# Altium project 40A DC-DC.PrjPcb
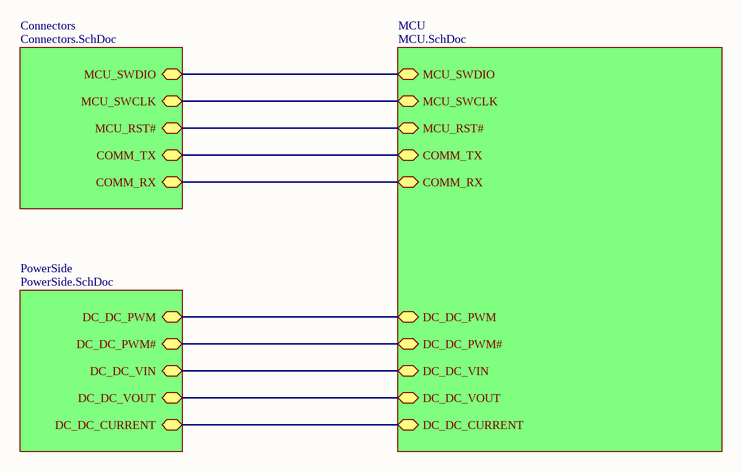
[diagram p0: Main.SchDoc]
ProjectAuthor: NeoProg; ProjectRevision: 1.00; ProjectStatus: D
4 sheets, 72 parts. Net scope: hierarchical (ports join the sheet entries above them; power ports are global).
Board file: PCB.PcbDoc
Sheets:
  Main.SchDoc
    Connectors = Connectors.SchDoc
    MCU = MCU.SchDoc
    PowerSide = PowerSide.SchDoc

## Sheet Main.SchDoc
size A4; DocumentNumber: 1; SheetNumber: 1; SheetTotal: 6

### Sub-sheets
Connectors = Connectors.SchDoc: MCU_SWDIO, MCU_SWCLK, MCU_RST#, COMM_TX, COMM_RX
MCU = MCU.SchDoc: MCU_SWDIO, MCU_SWCLK, MCU_RST#, DC_DC_PWM, DC_DC_PWM#, DC_DC_VIN, DC_DC_VOUT, DC_DC_CURRENT, COMM_TX, COMM_RX
PowerSide = PowerSide.SchDoc: DC_DC_PWM, DC_DC_PWM#, DC_DC_VIN, DC_DC_VOUT, DC_DC_CURRENT

### Nets
COMM_RX: sheet Connectors/COMM_RX, sheet MCU/COMM_RX
COMM_TX: sheet Connectors/COMM_TX, sheet MCU/COMM_TX
DC_DC_CURRENT: sheet MCU/DC_DC_CURRENT, sheet PowerSide/DC_DC_CURRENT
DC_DC_PWM: sheet MCU/DC_DC_PWM, sheet PowerSide/DC_DC_PWM
DC_DC_PWM#: sheet MCU/DC_DC_PWM#, sheet PowerSide/DC_DC_PWM#
DC_DC_VIN: sheet MCU/DC_DC_VIN, sheet PowerSide/DC_DC_VIN
DC_DC_VOUT: sheet MCU/DC_DC_VOUT, sheet PowerSide/DC_DC_VOUT
MCU_RST#: sheet Connectors/MCU_RST#, sheet MCU/MCU_RST#
MCU_SWCLK: sheet Connectors/MCU_SWCLK, sheet MCU/MCU_SWCLK
MCU_SWDIO: sheet Connectors/MCU_SWDIO, sheet MCU/MCU_SWDIO

### Notes on the sheet
- Project:
- Title:
- HW Rev:
- Author:
- Date:
- Sheet
- of

## Sheet Connectors.SchDoc
size A4
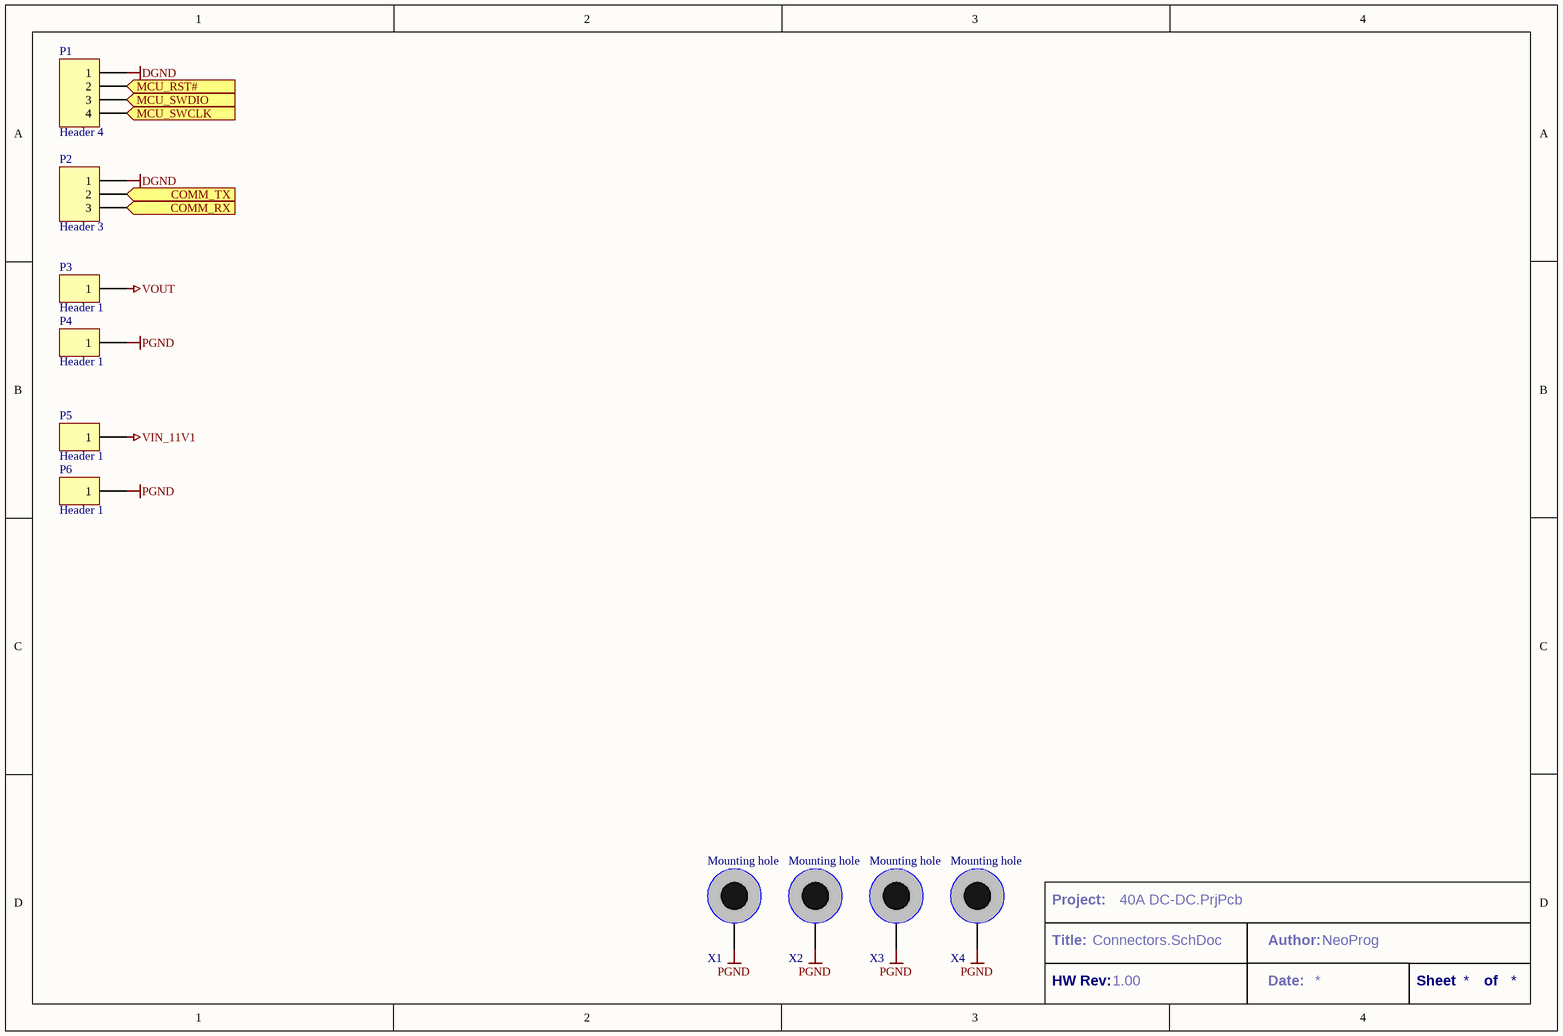
[diagram p1: Connectors.SchDoc]

### Parts
P1  Header 4  [HDR_SMD_1X4_1.50]
P2  Header 3  [HDR_SMD_1X3_1.50]
P3  Header 1  [WIRE_SMD_5X5]
P4  Header 1  [WIRE_SMD_5X5]
P5  Header 1  [WIRE_SMD_5X5]
P6  Header 1  [WIRE_SMD_5X5]
X1  Mounting hole  [HOLE_M3_D6.0/3.5]  (no BOM)
X2  Mounting hole  [HOLE_M3_D6.0/3.5]  (no BOM)
X3  Mounting hole  [HOLE_M3_D6.0/3.5]  (no BOM)
X4  Mounting hole  [HOLE_M3_D6.0/3.5]  (no BOM)

### Ports
COMM_RX, COMM_TX, MCU_RST#, MCU_SWCLK, MCU_SWDIO

### Nets
DGND: P1.1 P2.1
PGND: P4.1 P6.1 X1.1 X2.1 X3.1 X4.1
VIN_11V1: P5.1
VOUT: P3.1
COMM_RX: P2.3 ; port COMM_RX
COMM_TX: P2.2 ; port COMM_TX
MCU_RST#: P1.2 ; port MCU_RST#
MCU_SWCLK: P1.4 ; port MCU_SWCLK
MCU_SWDIO: P1.3 ; port MCU_SWDIO

### Notes on the sheet
- Project:
- Title:
- HW Rev:
- Author:
- Date:
- Sheet
- of

### Library data of the parts
P1 = Header 4: Header, 4-Pin; LatestRevisionDate: 17-Jul-2002; LatestRevisionNote: Re-released for DXP Platform.; Publisher: Altium Limited
P2 = Header 3: Header, 3-Pin; LatestRevisionDate: 17-Jul-2002; LatestRevisionNote: Re-released for DXP Platform.; Publisher: Altium Limited
P3-P6 = Header 1: Header, 1-Pin; LatestRevisionDate: 17-Jul-2002; LatestRevisionNote: Re-released for DXP Platform.; Publisher: Altium Limited
X1-X4 = Mounting hole: Hole for screw M3, outline D6

## Sheet MCU.SchDoc
size A4
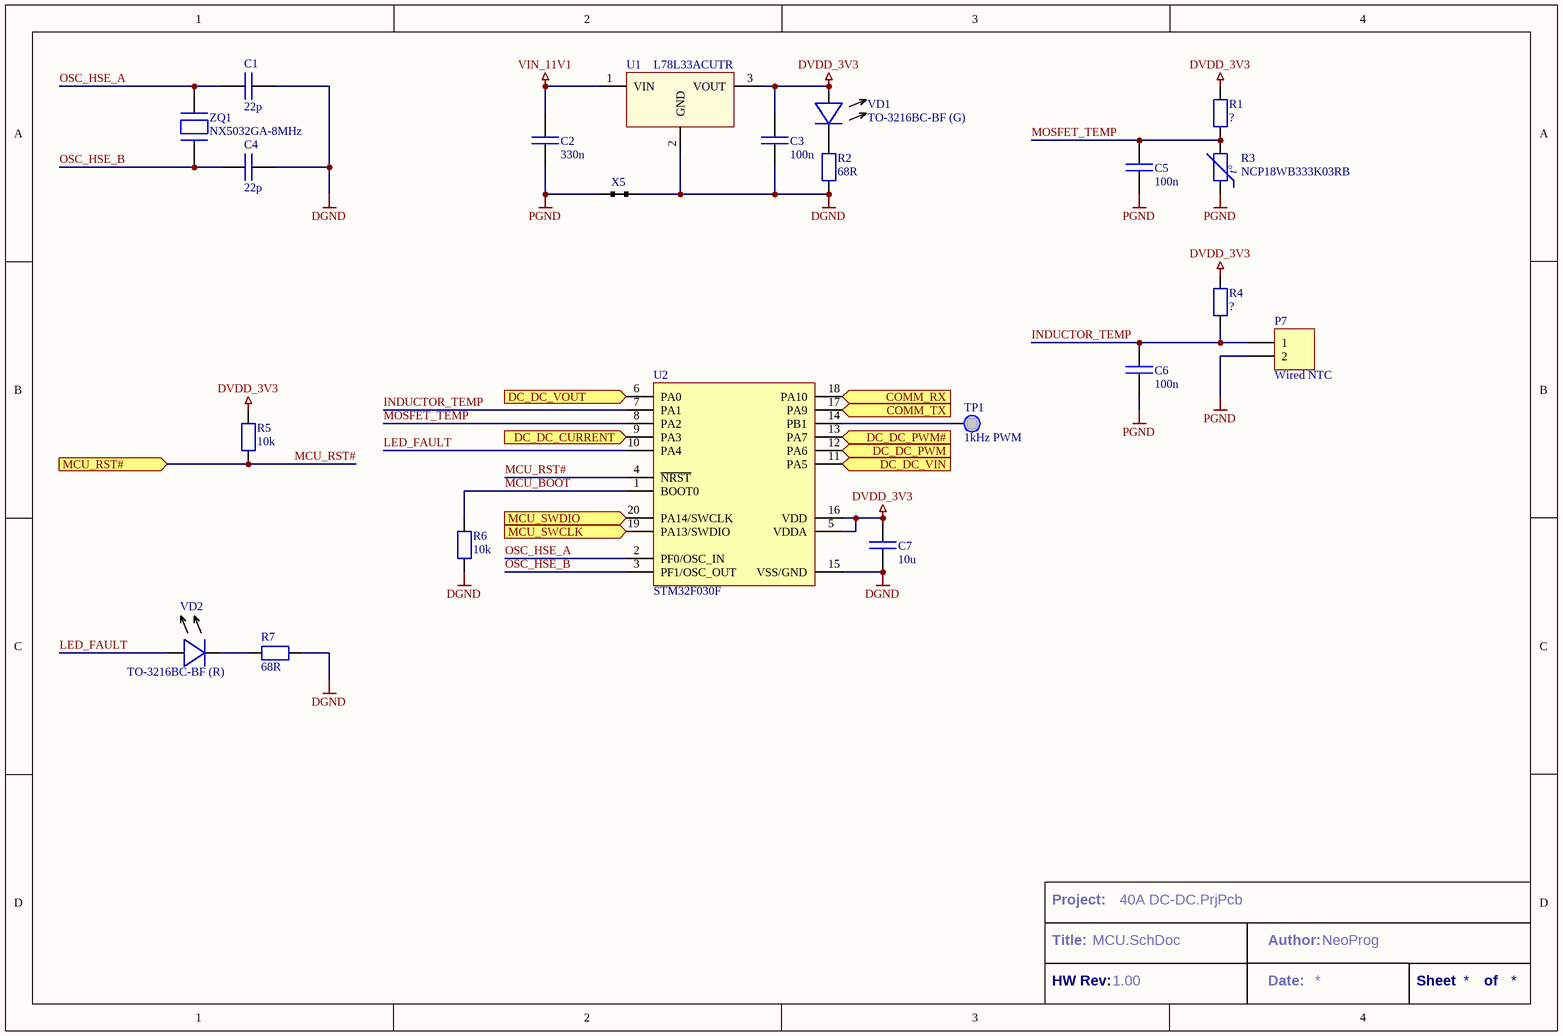
[diagram p2: MCU.SchDoc]

### Parts
C1  22p  [C_0603/1608]
C2  330n  [C_0805/2012]
C3  100n  [C_0805/2012]
C4  22p  [C_0603/1608]
C5  100n  [C_0603/1608]
C6  100n  [C_0603/1608]
C7  10u  [C_0603/1608]
P7  Wired NTC  [HDR_SMD_1X2_1.50]
R1  ?  [R_0603/1608]
R2  68R  [R_0603/1608]
R3  NCP18WB333K03RB  [R_0603/1608]
R4  ?  [R_0603/1608]
R5  10k  [R_0603/1608]
R6  10k  [R_0603/1608]
R7  68R  [R_0603/1608]
TP1  1kHz PWM  [TP_SMD_D1.00]  (no BOM)
U1  L78L33ACUTR  [SOT89]
U2  STM32F030F  [TSSOP20]
VD1  TO-3216BC-BF (G)  [LED_0603/1608]
VD2  TO-3216BC-BF (R)  [LED_0603/1608]
X5  (no value)  [NET_TIE_0.8]  (net tie, no BOM)
ZQ1  NX5032GA-8MHz  [OSC_2PINS SMD]

### Ports
COMM_RX, COMM_TX, DC_DC_CURRENT, DC_DC_PWM, DC_DC_PWM#, DC_DC_VIN, DC_DC_VOUT, MCU_RST#, MCU_SWCLK, MCU_SWDIO

### Nets
DGND: C1.2 C3.2 C4.2 C7.2 R2.1 R6.1 R7.2 U1.2(GND) U2.15(VSS/GND) X5.2
DVDD_3V3: C3.1 C7.1 R1.2 R4.2 R5.2 U1.3(VOUT) U2.5(VDDA) U2.16(VDD) VD1.A(Anode)
PGND: C2.2 C5.2 C6.2 P7.2 R3.1 X5.1
VIN_11V1: C2.1 U1.1(VIN)
COMM_RX: U2.18(PA10) ; port COMM_RX
COMM_TX: U2.17(PA9) ; port COMM_TX
DC_DC_CURRENT: U2.9(PA3) ; port DC_DC_CURRENT
DC_DC_PWM: U2.12(PA6) ; port DC_DC_PWM
DC_DC_PWM#: U2.13(PA7) ; port DC_DC_PWM#
DC_DC_VIN: U2.11(PA5) ; port DC_DC_VIN
DC_DC_VOUT: U2.6(PA0) ; port DC_DC_VOUT
INDUCTOR_TEMP: C6.1 P7.1 R4.1 U2.7(PA1)
LED_FAULT: U2.10(PA4) VD2.A(Anode)
MCU_BOOT: R6.2 U2.1(BOOT0)
MCU_RST#: R5.1 U2.4(~{NRST}) ; port MCU_RST#
MCU_SWCLK: U2.19(PA13/SWDIO) ; port MCU_SWCLK
MCU_SWDIO: U2.20(PA14/SWCLK) ; port MCU_SWDIO
MOSFET_TEMP: C5.1 R1.1 R3.2 U2.8(PA2)
OSC_HSE_A: C1.1 U2.2(PF0/OSC_IN) ZQ1.2
OSC_HSE_B: C4.1 U2.3(PF1/OSC_OUT) ZQ1.1
NetR2_2: R2.2 VD1.C(Cathode)
NetR7_1: R7.1 VD2.C(Cathode)
NetTP1_1: TP1.1 U2.14(PB1)

Not connected (* = marked no-connect by the designer): U2 0(EP)

### Notes on the sheet
- Project:
- Title:
- HW Rev:
- Author:
- Date:
- Sheet
- of
- (in symbol Termistor) t°

### Library data of the parts
C1-C7 = Capacitor: Non-polarized capacitor
P7 = Header 2: Header, 2-Pin; LatestRevisionDate: 17-Jul-2002; LatestRevisionNote: Re-released for DXP Platform.; Publisher: Altium Limited
R1 R2 R4-R7 = Resistor
R3 = Termistor
TP1 = Test point
U1 = L78L: LDO voltage regulator
U2 = STM32F030F: 32-bit Cortex-M0
VD1 VD2 = LED
X5 = Net tie
ZQ1 = Crystal oscillator

## Sheet PowerSide.SchDoc
size A4
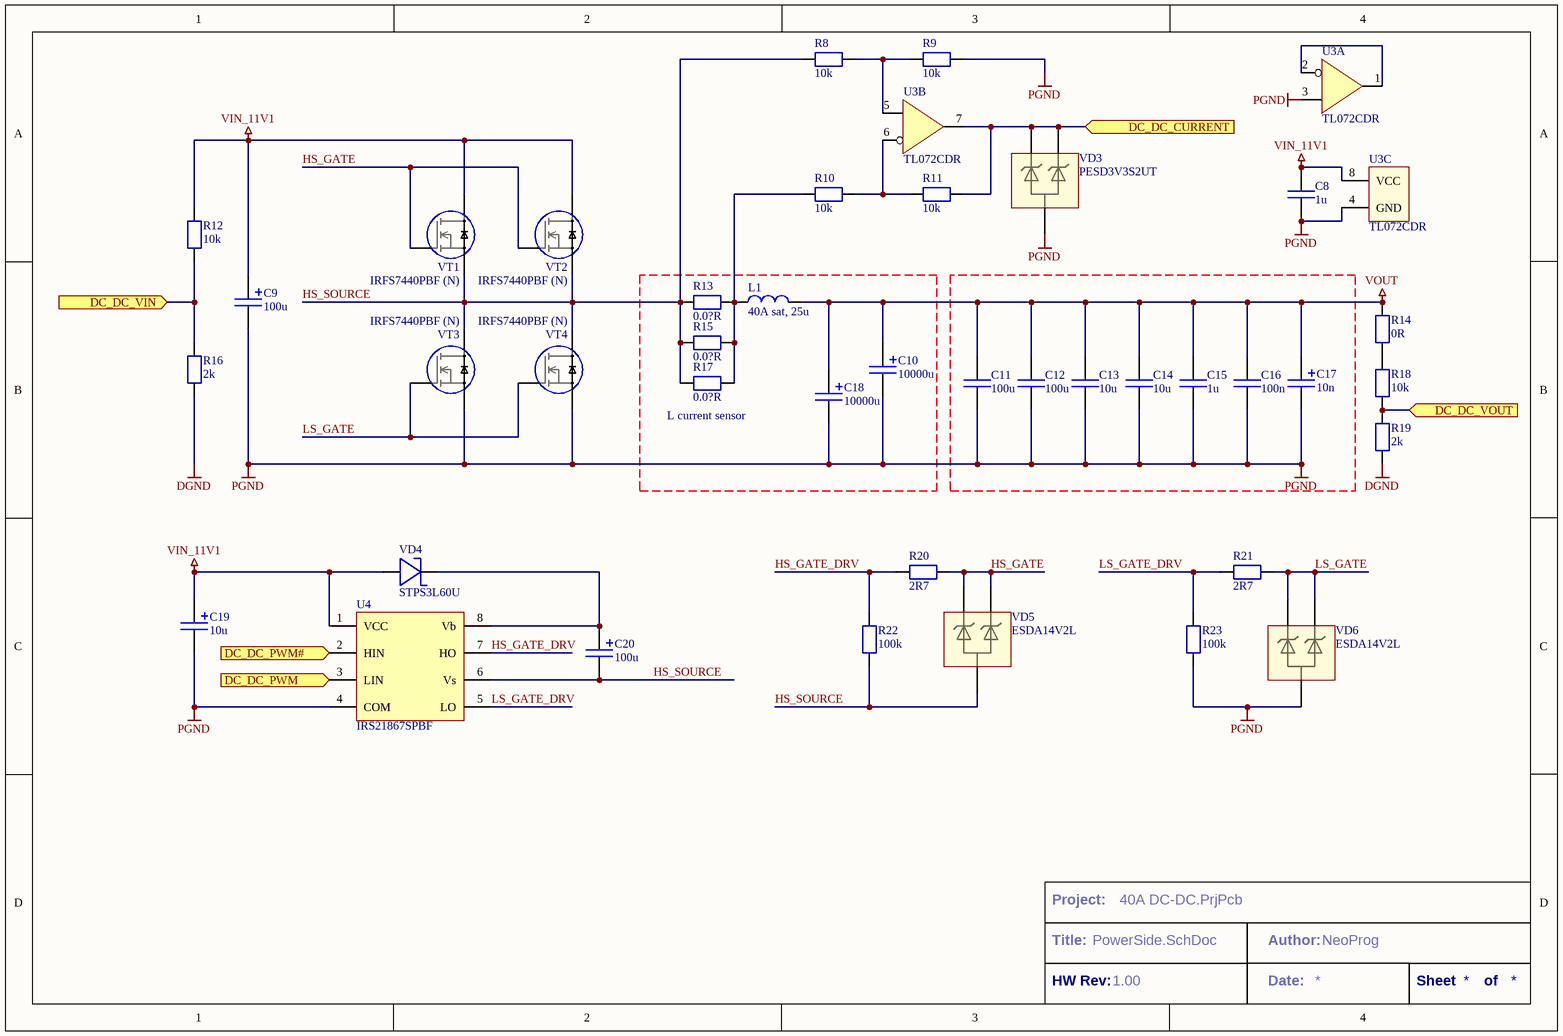
[diagram p3: PowerSide.SchDoc]

### Parts
C8  1u  [C_0805/2012]
C9  100u  [TECAP_TYPE_D]
C10  10000u  [C_ELECTROLYTIC_6x35]
C11  100u  [C_1206/3216]
C12  100u  [C_1206/3216]
C13  10u  [C_1206/3216]
C14  10u  [C_1206/3216]
C15  1u  [C_1206/3216]
C16  100n  [C_1206/3216]
C17  10n  [TECAP_TYPE_D]
C18  10000u  [C_ELECTROLYTIC_6x35]
C19  10u  [TECAP_TYPE_D]
C20  100u  [TECAP_TYPE_D]
L1  40A sat, 25u  [L_30x20x10 _SMD]
R8  10k  [R_0603/1608]
R9  10k  [R_0603/1608]
R10  10k  [R_0402/1005]
R11  10k  [R_0402/1005]
R12  10k  [R_0402/1005]
R13  0.0?R  [R_2512/6332]
R14  0R  [R_0603/1608]
R15  0.0?R  [R_2512/6332]
R16  2k  [R_0402/1005]
R17  0.0?R  [R_2512/6332]
R18  10k  [R_0603/1608]
R19  2k  [R_0603/1608]
R20  2R7  [R_1206/3216]
R21  2R7  [R_1206/3216]
R22  100k  [R_0805/2012]
R23  100k  [R_0805/2012]
U3  TL072CDR  [SO8_1.27]  (parts A,B,C of 3)
U4  IRS21867SPBF  [SO8_1.27]
VD3  PESD3V3S2UT  [SOT23-3]
VD4  STPS3L60U  [DO214AA/SMB]
VD5  ESDA14V2L  [SOT23-3]
VD6  ESDA14V2L  [SOT23-3]
VT1  IRFS7440PBF (N)  [TO263-2/D2PAK-2]
VT2  IRFS7440PBF (N)  [TO263-2/D2PAK-2]
VT3  IRFS7440PBF (N)  [TO263-2/D2PAK-2]
VT4  IRFS7440PBF (N)  [TO263-2/D2PAK-2]

### Blocks framed on the sheet
L current sensor: C10 C18 L1 R13 R15 R17

### Ports
DC_DC_CURRENT, DC_DC_PWM, DC_DC_PWM#, DC_DC_VIN, DC_DC_VOUT

### Nets
DGND: R16.1 R19.1
PGND: C8.1 C9.2(NEG) C10.2(NEG) C11.1 C12.1 C13.1 C14.1 C15.1 C16.1 C17.2(NEG) C18.2(NEG) C19.2(NEG) R9.1 R23.2 U3.3 U3.4(GND) U4.4(COM) VD3.A VD6.A VT3.S VT4.S
VIN_11V1: C8.2 C9.1(POS) C19.1(POS) R12.2 U3.8(VCC) U4.1(VCC) VD4.A VT1.D VT2.D
VOUT: C10.1(POS) C11.2 C12.2 C13.2 C14.2 C15.2 C16.2 C17.1(POS) C18.1(POS) L1.2 R14.2
DC_DC_CURRENT: R11.1 U3.7(OUT) VD3.1C VD3.2C ; port DC_DC_CURRENT
DC_DC_PWM: U4.3(LIN) ; port DC_DC_PWM
DC_DC_PWM#: U4.2(HIN) ; port DC_DC_PWM#
DC_DC_VIN: R12.1 R16.2 ; port DC_DC_VIN
DC_DC_VOUT: R18.1 R19.2 ; port DC_DC_VOUT
HS_GATE: R20.2 VD5.1C VD5.2C VT1.G VT2.G
HS_GATE_DRV: R20.1 R22.1 U4.7(HO)
HS_SOURCE: C20.2(NEG) R8.2 R13.2 R15.2 R17.2 R22.2 U4.6(Vs) VD5.A VT1.S VT2.S VT3.D VT4.D
LS_GATE: R21.2 VD6.1C VD6.2C VT3.G VT4.G
LS_GATE_DRV: R21.1 R23.1 U4.5(LO)
NetC20_1: C20.1(POS) U4.8(Vb) VD4.C(C`)
NetL1_1: L1.1 R10.2 R13.1 R15.1 R17.1
NetR8_1: R8.1 R9.2 U3.5
NetR10_1: R10.1 R11.2 U3.6
NetR14_1: R14.1 R18.2
NetU3_1: U3.1(OUT) U3.2

### Notes on the sheet
- Project:
- Title:
- HW Rev:
- Author:
- Date:
- Sheet
- of

### Library data of the parts
C8 C11-C16 = Capacitor: Non-polarized capacitor
C9 C10 C17-C20 = Capacitor polar: Polarized capacitor
L1 = Inductor: pin to pad: 1>2 2>1
R8-R23 = Resistor
U3 = Op-amp dual: Dual operation amplifier
U4 = IRS21867SPBF: MOSFET driver
VD3 VD5 VD6 = TVS x2 A-COM: TVS x2; pin to pad: 1C>1 2C>2 A>3
VD4 = Schottky: Schottky diode; pin to pad: A>2 C>1
VT1-VT4 = MOSFET N: pin to pad: D>3 G>1 S>2

## Nets that join several sheets
DGND: Connectors (P1.1 P2.1), MCU (10 pins), PowerSide (R16.1 R19.1)
PGND: Connectors (6 pins), MCU (6 pins), PowerSide (21 pins)
VIN_11V1: Connectors (P5.1), MCU (C2.1 U1.1), PowerSide (9 pins)
VOUT: Connectors (P3.1), PowerSide (11 pins)
COMM_RX: Connectors (P2.3), MCU (U2.18)
COMM_TX: Connectors (P2.2), MCU (U2.17)
DC_DC_CURRENT: MCU (U2.9), PowerSide (R11.1 U3.7 VD3.1C VD3.2C)
DC_DC_PWM: MCU (U2.12), PowerSide (U4.3)
DC_DC_PWM#: MCU (U2.13), PowerSide (U4.2)
DC_DC_VIN: MCU (U2.11), PowerSide (R12.1 R16.2)
DC_DC_VOUT: MCU (U2.6), PowerSide (R18.1 R19.2)
MCU_RST#: Connectors (P1.2), MCU (R5.1 U2.4)
MCU_SWCLK: Connectors (P1.4), MCU (U2.19)
MCU_SWDIO: Connectors (P1.3), MCU (U2.20)

## Assembly variants
Base: all parts fitted